# Altium schematic sheet [4]-USB2, TYPEC, USIC.SchDoc: RK3399 SOM Board Design V1.0
size A4; Author: AVIRAL MISHRA; DocumentNumber: 5; SheetNumber: 5; SheetTotal: 12; PROJECT CODE: A_V1.0
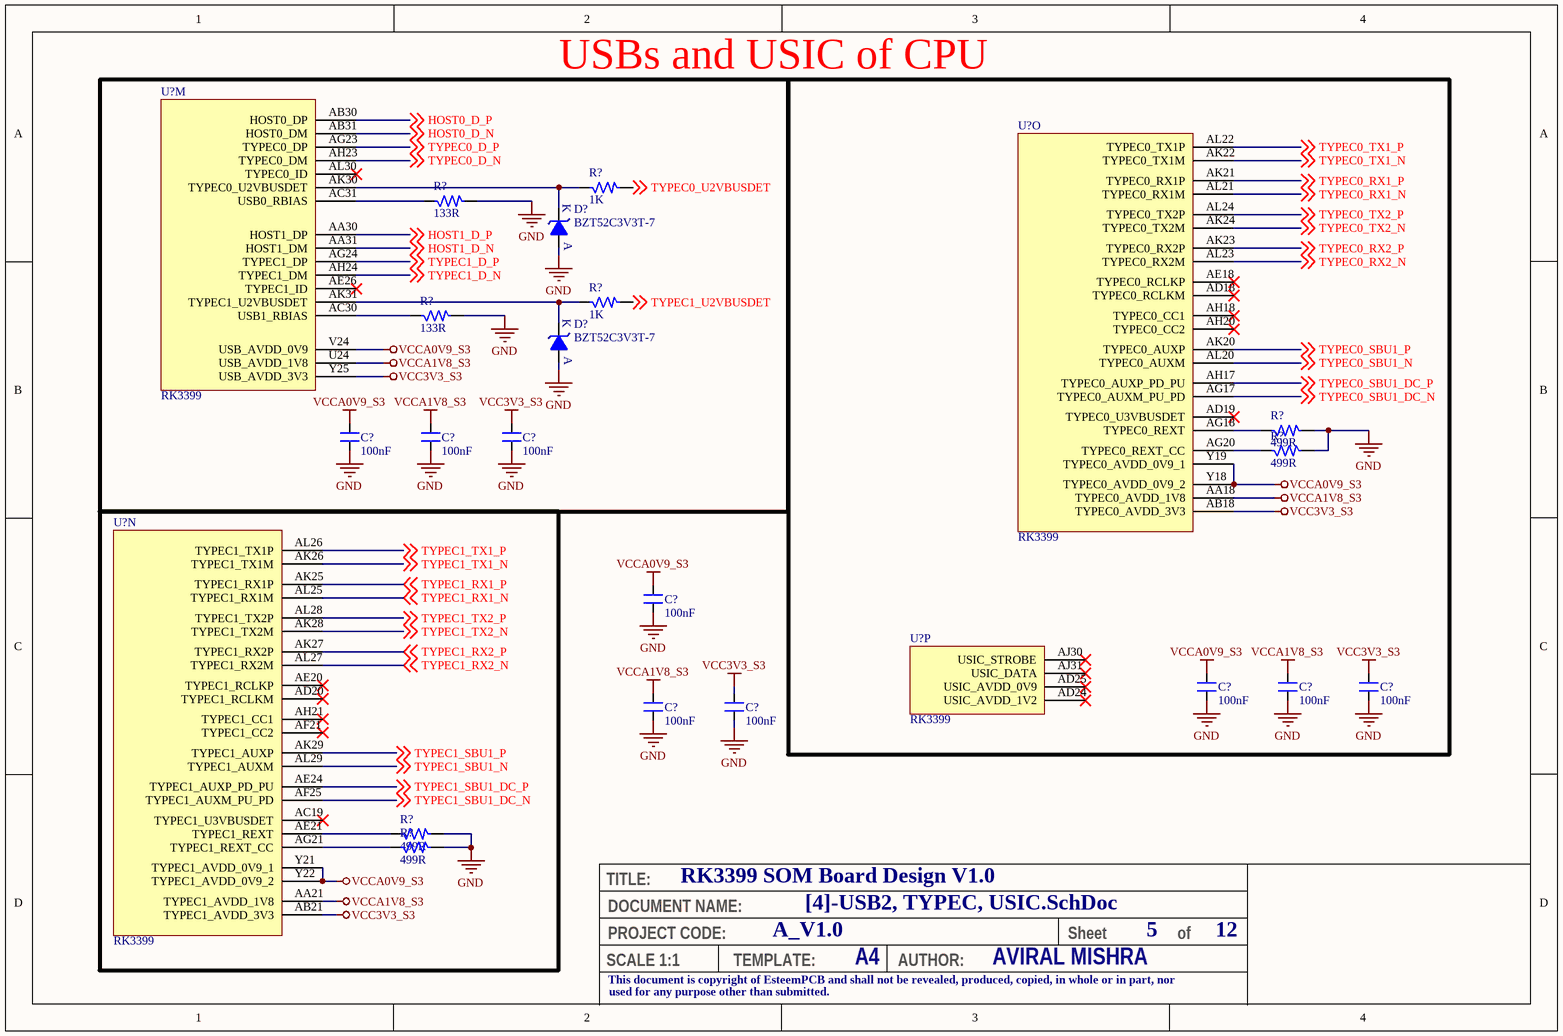
[diagram p0: [4]-USB2, TYPEC, USIC.SchDoc]

## Parts
(Parts that share a designator on the sheet are numbered #1, #2 ... from top to bottom, then left to right.)
C?#1  100nF  [CAP_0201]
C?#2  100nF  [CAP_0201]
C?#3  100nF  [CAP_0201]
C?#4  100nF  [CAP_0201]
C?#5  100nF  [CAP_0201]
C?#6  100nF  [CAP_0201]
C?#7  100nF  [CAP_0201]
C?#8  100nF  [CAP_0201]
C?#9  100nF  [CAP_0201]
D?#1  BZT52C3V3T-7  [DIO_SOD523]
D?#2  BZT52C3V3T-7  [DIO_SOD523]
R?#1  1K  [RES_0201]
R?#2  133R  [RES_0201]
R?#3  1K  [RES_0201]
R?#4  133R  [RES_0201]
R?#5  499R  [RES_0201]
R?#6  499R  [RES_0201]
R?#7  499R  [RES_0201]
R?#8  499R  [RES_0201]
U?#1  RK3399  [FBGA828_23_826X826]  (part M of 24)
U?#2  RK3399  [FBGA828_23_826X826]  (part O of 24)
U?#3  RK3399  [FBGA828_23_826X826]  (part N of 24)
U?#4  RK3399  [FBGA828_23_826X826]  (part P of 24)

## Blocks framed on the sheet
USBs and USIC of CPU: C?#1-C?#3 D?#1 D?#2 R?#1-R?#4 U?#1

## Nets
GND: C?#1.2 C?#2.1 C?#3.1 C?#4.1 C?#5.1 C?#6.1 C?#7.1 C?#8.1 C?#9.1 D?#1.A D?#2.A R?#2.2 R?#4.2 R?#5.2 R?#6.2 R?#7.2 R?#8.2
VCC3V3_S3: C?#3.2 C?#7.2 C?#9.2 U?#1.Y25(USB_AVDD_3V3) U?#2.AB18(TYPEC0_AVDD_3V3) U?#3.AB21(TYPEC1_AVDD_3V3)
VCCA0V9_S3: C?#1.1 C?#4.2 C?#5.2 U?#1.V24(USB_AVDD_0V9) U?#2.Y18(TYPEC0_AVDD_0V9_2) U?#2.Y19(TYPEC0_AVDD_0V9_1) U?#3.Y21(TYPEC1_AVDD_0V9_1) U?#3.Y22(TYPEC1_AVDD_0V9_2)
VCCA1V8_S3: C?#2.2 C?#6.2 C?#8.2 U?#1.U24(USB_AVDD_1V8) U?#2.AA18(TYPEC0_AVDD_1V8) U?#3.AA21(TYPEC1_AVDD_1V8)
HOST0_D_N: U?#1.AB31(HOST0_DM) ; off-sheet HOST0_D_N
HOST0_D_P: U?#1.AB30(HOST0_DP) ; off-sheet HOST0_D_P
HOST1_D_N: U?#1.AA31(HOST1_DM) ; off-sheet HOST1_D_N
HOST1_D_P: U?#1.AA30(HOST1_DP) ; off-sheet HOST1_D_P
TYPEC0_D_N: U?#1.AH23(TYPEC0_DM) ; off-sheet TYPEC0_D_N
TYPEC0_D_P: U?#1.AG23(TYPEC0_DP) ; off-sheet TYPEC0_D_P
TYPEC0_RX1_N: U?#2.AL21(TYPEC0_RX1M) ; off-sheet TYPEC0_RX1_N
TYPEC0_RX1_P: U?#2.AK21(TYPEC0_RX1P) ; off-sheet TYPEC0_RX1_P
TYPEC0_RX2_N: U?#2.AL23(TYPEC0_RX2M) ; off-sheet TYPEC0_RX2_N
TYPEC0_RX2_P: U?#2.AK23(TYPEC0_RX2P) ; off-sheet TYPEC0_RX2_P
TYPEC0_SBU1_DC_N: U?#2.AG17(TYPEC0_AUXM_PU_PD) ; off-sheet TYPEC0_SBU1_DC_N
TYPEC0_SBU1_DC_P: U?#2.AH17(TYPEC0_AUXP_PD_PU) ; off-sheet TYPEC0_SBU1_DC_P
TYPEC0_SBU1_N: U?#2.AL20(TYPEC0_AUXM) ; off-sheet TYPEC0_SBU1_N
TYPEC0_SBU1_P: U?#2.AK20(TYPEC0_AUXP) ; off-sheet TYPEC0_SBU1_P
TYPEC0_TX1_N: U?#2.AK22(TYPEC0_TX1M) ; off-sheet TYPEC0_TX1_N
TYPEC0_TX1_P: U?#2.AL22(TYPEC0_TX1P) ; off-sheet TYPEC0_TX1_P
TYPEC0_TX2_N: U?#2.AK24(TYPEC0_TX2M) ; off-sheet TYPEC0_TX2_N
TYPEC0_TX2_P: U?#2.AL24(TYPEC0_TX2P) ; off-sheet TYPEC0_TX2_P
TYPEC0_U2VBUSDET: R?#1.2 ; off-sheet TYPEC0_U2VBUSDET
TYPEC1_D_N: U?#1.AH24(TYPEC1_DM) ; off-sheet TYPEC1_D_N
TYPEC1_D_P: U?#1.AG24(TYPEC1_DP) ; off-sheet TYPEC1_D_P
TYPEC1_RX1_N: U?#3.AL25(TYPEC1_RX1M) ; off-sheet TYPEC1_RX1_N
TYPEC1_RX1_P: U?#3.AK25(TYPEC1_RX1P) ; off-sheet TYPEC1_RX1_P
TYPEC1_RX2_N: U?#3.AL27(TYPEC1_RX2M) ; off-sheet TYPEC1_RX2_N
TYPEC1_RX2_P: U?#3.AK27(TYPEC1_RX2P) ; off-sheet TYPEC1_RX2_P
TYPEC1_SBU1_DC_N: U?#3.AF25(TYPEC1_AUXM_PU_PD) ; off-sheet TYPEC1_SBU1_DC_N
TYPEC1_SBU1_DC_P: U?#3.AE24(TYPEC1_AUXP_PD_PU) ; off-sheet TYPEC1_SBU1_DC_P
TYPEC1_SBU1_N: U?#3.AL29(TYPEC1_AUXM) ; off-sheet TYPEC1_SBU1_N
TYPEC1_SBU1_P: U?#3.AK29(TYPEC1_AUXP) ; off-sheet TYPEC1_SBU1_P
TYPEC1_TX1_N: U?#3.AK26(TYPEC1_TX1M) ; off-sheet TYPEC1_TX1_N
TYPEC1_TX1_P: U?#3.AL26(TYPEC1_TX1P) ; off-sheet TYPEC1_TX1_P
TYPEC1_TX2_N: U?#3.AK28(TYPEC1_TX2M) ; off-sheet TYPEC1_TX2_N
TYPEC1_TX2_P: U?#3.AL28(TYPEC1_TX2P) ; off-sheet TYPEC1_TX2_P
TYPEC1_U2VBUSDET: R?#3.2 ; off-sheet TYPEC1_U2VBUSDET
NetD?#1_K: D?#1.K R?#1.1 U?#1.AK30(TYPEC0_U2VBUSDET)
NetD?#2_K: D?#2.K R?#3.1 U?#1.AK31(TYPEC1_U2VBUSDET)
NetR?#2_1: R?#2.1 U?#1.AC31(USB0_RBIAS)
NetR?#4_1: R?#4.1 U?#1.AC30(USB1_RBIAS)
NetR?#5_1: R?#5.1 U?#2.AG18(TYPEC0_REXT)
NetR?#6_1: R?#6.1 U?#2.AG20(TYPEC0_REXT_CC)
NetR?#7_1: R?#7.1 U?#3.AE21(TYPEC1_REXT)
NetR?#8_1: R?#8.1 U?#3.AG21(TYPEC1_REXT_CC)

Not connected (* = marked no-connect by the designer): U?#1 AE26(TYPEC1_ID)* AL30(TYPEC0_ID)*; U?#2 AD18(TYPEC0_RCLKM)* AD19(TYPEC0_U3VBUSDET)* AE18(TYPEC0_RCLKP)* AH18(TYPEC0_CC1)* AH20(TYPEC0_CC2)*; U?#3 AC19(TYPEC1_U3VBUSDET)* AD20(TYPEC1_RCLKM)* AE20(TYPEC1_RCLKP)* AF21(TYPEC1_CC2)* AH21(TYPEC1_CC1)*; U?#4 AD24(USIC_AVDD_1V2)* AD25(USIC_AVDD_0V9)* AJ30(USIC_STROBE)* AJ31(USIC_DATA)*

## Notes on the sheet
- TITLE:
- DOCUMENT NAME:
- SCALE 1:1
- This document is copyright of EsteemPCB and shall not be revealed, produced, copied, in whole or in part, nor
- PROJECT CODE:
- TEMPLATE:
- A4
- AUTHOR:
- Sheet
- of
- used for any purpose other than submitted.

## Library data of the parts
C?#1-C?#9 = CAP_100nF-25V-10%-0201: 0.1µF ±10% 25V Ceramic Capacitor X5R 0201 (0603 Metric) /; Manufacturer: TDK Corporation; Manufacturer Part Number: C0603X5R1E104K030BB; Case/Package: 0201; Supplier-1: Digikey
D?#1 D?#2 = DIO-Z_3.3V-300mW-SOD-523: Zener Diode 3.3V 300mW ±6% Surface Mount SOD-523 /; Manufacturer: Diodes Incorporated; Manufacturer Part Number: BZT52C3V3T-7; Case/Package: SOD523; Supplier-1: Digikey
R?#1 R?#3 = RES_1K-0.05W-1%-0201: 1 kOhms ±1% 0.05W, 1/20W Chip Resistor 0201 (0603 Metric) Thick Film /; Manufacturer: Yageo; Manufacturer Part Number: RC0201FR-071KL; Case/Package: 0201; Supplier-1: Digikey
R?#2 R?#4 = RES_133R-0.05W-1%-0201: 133 Ohms ±1% 0.05W, 1/20W Chip Resistor 0201 (0603 Metric) Automotive AEC-Q200 Thick Film /; Manufacturer: Panasonic Electronic Components; Manufacturer Part Number: ERJ-1GNF1330C; Case/Package: 0201; Supplier-1: Digikey
R?#5-R?#8 = RES_499R-0.05W-1%-0201: 499 Ohms ±1% 0.05W, 1/20W Chip Resistor 0201 (0603 Metric) Thick Film /; Manufacturer: Stackpole Electronics Inc; Manufacturer Part Number: RMCF0201FT499R; Case/Package: 0201; Supplier-1: Digikey
U?#1-U?#4 = IC_RK3399-FCBGA828: RK3399 is a low power, high performance processor for computing, personal mobile.; Manufacturer: Rockchip; Manufacturer Part Number: RK3399; Case/Package: FCBGA828; Supplier-1: Rockchip